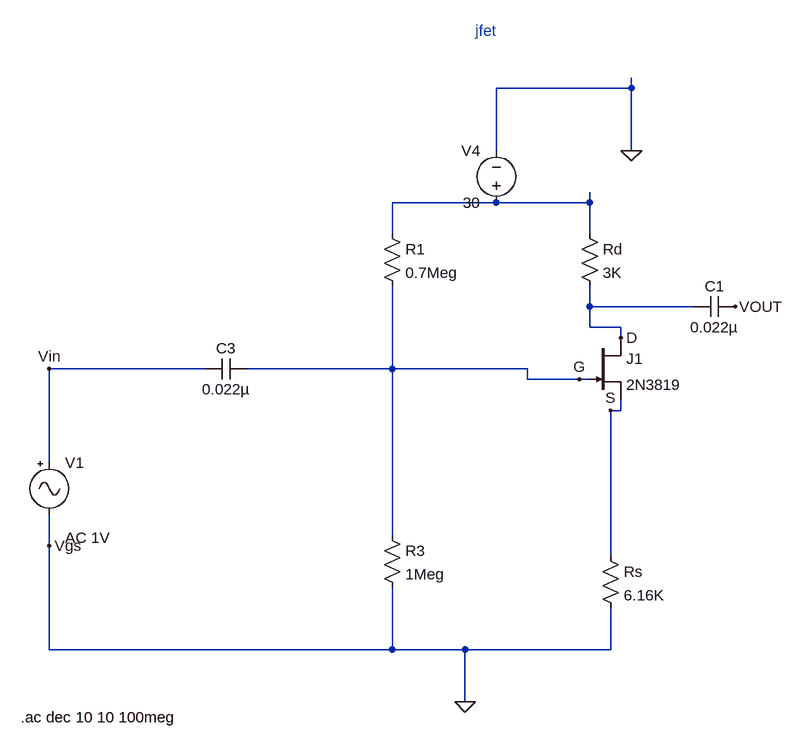
[diagram p0: schematic fet.asc]
fet.asc, the LTspice schematic file:
Version 4
SHEET 1 1008 952
WIRE 400 -32 400 -48
WIRE 400 -32 192 -32
WIRE 192 64 192 -32
WIRE 400 64 400 -32
WIRE 192 144 32 144
WIRE 336 144 336 128
WIRE 336 144 192 144
WIRE 32 192 32 144
WIRE 336 192 336 144
WIRE 336 304 336 272
WIRE 496 304 336 304
WIRE 336 336 336 304
WIRE 384 336 336 336
WIRE 384 352 384 336
WIRE -256 400 -496 400
WIRE 32 400 32 272
WIRE 32 400 -192 400
WIRE 240 400 32 400
WIRE 240 416 240 400
WIRE 320 416 240 416
WIRE 336 416 320 416
WIRE 384 464 384 448
WIRE 384 464 368 464
WIRE -496 544 -496 400
WIRE 32 656 32 400
WIRE -496 672 -496 624
WIRE 368 688 368 464
WIRE -496 832 -496 672
WIRE 32 832 32 736
WIRE 32 832 -496 832
WIRE 144 832 32 832
WIRE 368 832 368 768
WIRE 368 832 144 832
WIRE 144 912 144 832
FLAG 400 64 0
FLAG 144 912 0
FLAG -496 672 Vgs
FLAG -496 400 Vin
FLAG 320 416 G
FLAG 368 464 S
FLAG 384 352 D
FLAG 560 304 VOUT
SYMBOL voltage 192 160 R180
WINDOW 0 24 96 Left 2
WINDOW 3 24 16 Left 2
WINDOW 123 0 0 Left 0
WINDOW 39 0 0 Left 0
SYMATTR InstName V4
SYMATTR Value 30
SYMBOL res 16 176 R0
SYMATTR InstName R1
SYMATTR Value 0.7Meg
SYMBOL res 320 176 R0
SYMATTR InstName Rd
SYMATTR Value 3K
SYMBOL res 16 640 R0
SYMATTR InstName R3
SYMATTR Value 1Meg
SYMBOL res 352 672 R0
SYMATTR InstName Rs
SYMATTR Value 6.16K
SYMBOL cap -192 384 R90
WINDOW 0 0 32 VBottom 2
WINDOW 3 32 32 VTop 2
SYMATTR InstName C3
SYMATTR Value 0.022µ
SYMATTR SpiceLine V=6.3 Irms=0 Rser=0.001 Lser=0
SYMBOL Misc\\signal -496 528 R0
WINDOW 123 24 132 Left 2
WINDOW 39 0 0 Left 0
SYMATTR Value2 AC 1V
SYMATTR InstName V1
SYMATTR Value ""
SYMBOL njf 336 352 R0
SYMATTR InstName J1
SYMATTR Value 2N3819
SYMBOL cap 560 288 R90
WINDOW 0 0 32 VBottom 2
WINDOW 3 32 32 VTop 2
SYMATTR InstName C1
SYMATTR Value 0.022µ
SYMATTR SpiceLine V=6.3 Irms=0 Rser=0.001 Lser=0 mfg="TDK" pn="C3216X5ROJ106M" type="X5R"
TEXT -540 936 Left 2 !.ac dec 10 10 100meg
TEXT 160 -120 Left 2 ;jfet

The netlist it stands for:
* fet.asc
V4 N001 0 30
R1 N001 G 0.7Meg
Rd N001 D 3K
R3 G 0 1Meg
Rs S 0 6.16K
C3 G Vin 0.022µ V=6.3 Irms=0 Rser=0.001 Lser=0
V1 Vin 0 AC 1V
J1 D G S 2N3819
C1 VOUT D 0.022µ V=6.3 Irms=0 Rser=0.001 Lser=0 mfg="TDK" pn="C3216X5ROJ106M" type="X5R"
.model NJF NJF
.model PJF PJF
.lib standard.jft
.ac dec 10 10 100meg
* jfet
.backanno
.end